# EAGLE design PSocC Motor Driver Design 1 (EAGLE 7.5.0)
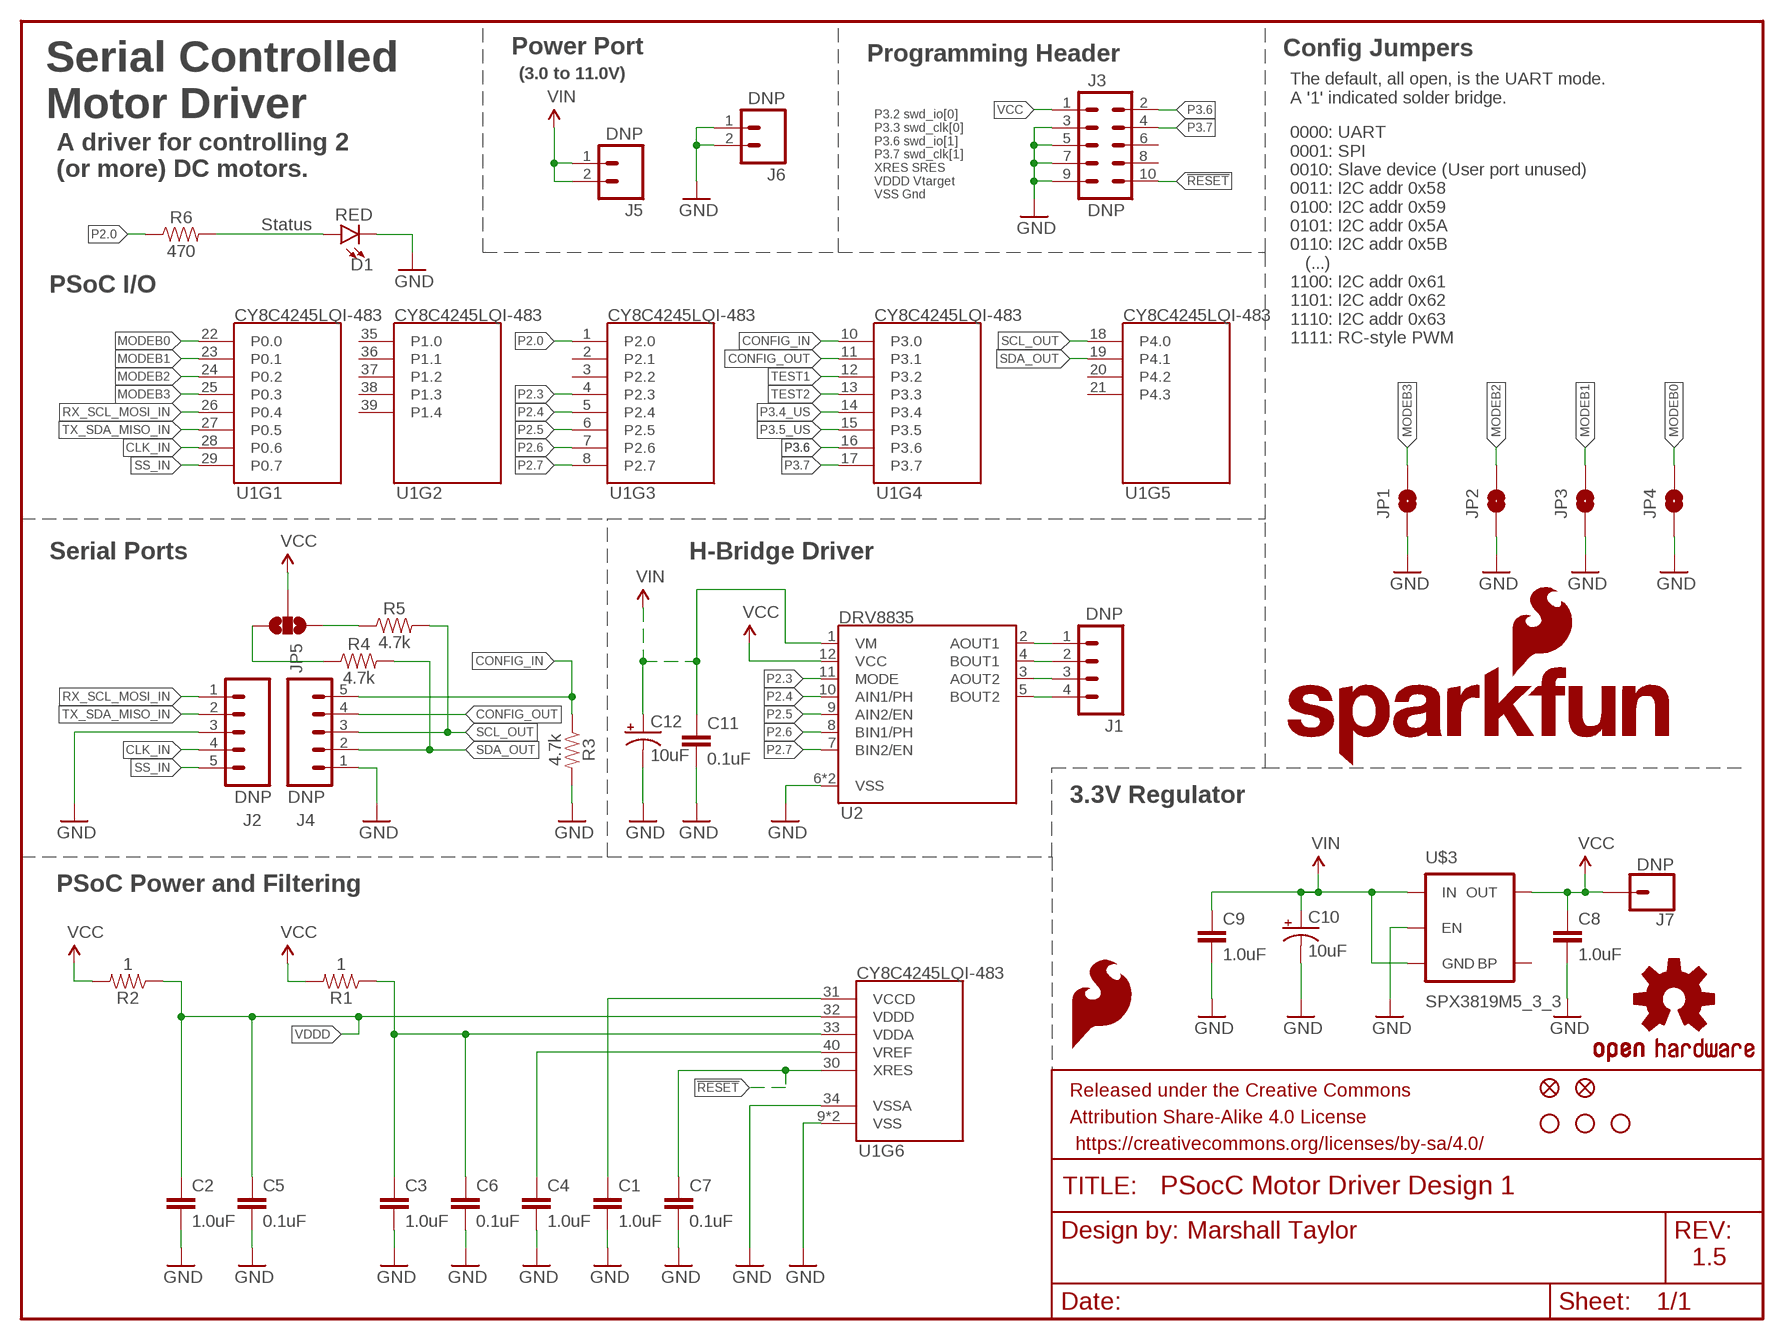
[diagram p0: schematic, sheet 1]

## Parts
C1  1.0uF  1.0UF-0402-16V-10%  [0402]
C2  1.0uF  1.0UF-0402-16V-10%  [0402]
C3  1.0uF  1.0UF-0402-16V-10%  [0402]
C4  1.0uF  1.0UF-0402-16V-10%  [0402]
C5  0.1uF  0.1UF-0402-16V-10%  [0402]
C6  0.1uF  0.1UF-0402-16V-10%  [0402]
C7  0.1uF  0.1UF-0402-16V-10%  [0402]
C8  1.0uF  1.0UF-0402-16V-10%  [0402]
C9  1.0uF  1.0UF-0402-16V-10%  [0402]
C10  10uF  10UF-POLAR-EIA3216-16V-10%(TANT)  [EIA3216]
C11  0.1uF  0.1UF-0402-16V-10%  [0402]
C12  10uF  10UF-POLAR-EIA3216-16V-10%(TANT)  [EIA3216]
D1  RED  LED-RED0603  [LED-0603]
FD1  FIDUCIALUFIDUCIAL  [MICRO-FIDUCIAL]
FD2  FIDUCIALUFIDUCIAL  [MICRO-FIDUCIAL]
FRAME1  FRAME-LETTER  [CREATIVE_COMMONS]
H1  STAND-OFF  [STAND-OFF]
H2  STAND-OFF  [STAND-OFF]
H3  STAND-OFF  [STAND-OFF]
J1  DNP  M04PTH  [1X04]
J2  DNP  M05PTH  [1X05]
J3  DNP  M05X20.05_IN_PTH_SILK  [2X5_PTH_SILK_.05]
J4  DNP  M05PTH  [1X05]
J5  DNP  M02PTH  [1X02]
J6  DNP  M02PTH  [1X02]
J7  DNP  CONN_01PTH  [1X01]
JP1  JUMPER-PAD-2  JUMPER-PAD-2-NOYES_SILK  [PAD-JUMPER-2-NO_YES_SILK]
JP2  JUMPER-PAD-2  JUMPER-PAD-2-NOYES_SILK  [PAD-JUMPER-2-NO_YES_SILK]
JP3  JUMPER-PAD-2  JUMPER-PAD-2-NOYES_SILK  [PAD-JUMPER-2-NO_YES_SILK]
JP4  JUMPER-PAD-2  JUMPER-PAD-2-NOYES_SILK  [PAD-JUMPER-2-NO_YES_SILK]
JP5  JUMPER-PAD-3-NOYES_SILK  [PAD-JUMPER-3-NO_YES_SILK]
LOGO1  SFE_LOGO_FLAME.1_INCH  [SFE_LOGO_FLAME_.1]
LOGO2  OSHW-LOGOMINI  [OSHW-LOGO-MINI]
LOGO3  SFE_LOGO_NAME_FLAME.1_INCH  [SFE_LOGO_NAME_FLAME_.1]
R1  1  1OHM-0603-1/10W-1%  [0603]
R2  1  1OHM-0603-1/10W-1%  [0603]
R3  4.7k  4.7KOHM-0603-1/10W-1%  [0603]
R4  4.7k  4.7KOHM-0603-1/10W-1%  [0603]
R5  4.7k  4.7KOHM-0603-1/10W-1%  [0603]
R6  470  470OHM-0603-1/10W-1%  [0603]
U1  CY8C4245LQI-483  CY8C4245LQI  [QFN-40]
U2  DRV8835  DRV883X  [WSON-12]
U$3  SPX3819M5_3_3  SPX3819  [SOT-23-5-VREG]

## Nets
!RESET: C7.1 J3.10 U1.30(XRES)
CLK_IN: J2.4 U1.28(P0.6)
CONFIG_IN: J4.5 R3.1 U1.10(P3.0)
CONFIG_OUT: J4.4 U1.11(P3.1)
GND: C1.2 C2.2 C3.2 C4.2 C5.2 C6.2 C7.2 C8.2 C9.2 C10.- C11.2 C12.- D1.C J2.3 J3.3 J3.5 J3.7 J3.9 J4.1 J6.1 J6.2 JP1.1 JP2.1 JP3.1 JP4.1 R3.2 U1.9(VSS) U1.34(VSSA) U1.EP(VSS) U2.6(VSS) U2.PAD(VSS) U$3.3(EN)
MODEB0: JP4.2 U1.22(P0.0)
MODEB1: JP3.2 U1.23(P0.1)
MODEB2: JP2.2 U1.24(P0.2)
MODEB3: JP1.2 U1.25(P0.3)
N$1: C1.1 U1.31(VCCD)
N$2: JP5.1 R5.1
N$3: C3.1 C6.1 R1.1 U1.33(VDDA)
N$4: C4.1 U1.40(VREF)
N$5: J1.1 U2.2(AOUT1)
N$6: J1.2 U2.4(BOUT1)
N$7: J1.4 U2.5(BOUT2)
N$8: J1.3 U2.3(AOUT2)
N$9: JP5.3 R4.1
N$10: D1.A R6.2
P2.0: R6.1 U1.1(P2.0)
P2.3: U1.4(P2.3) U2.11(MODE)
P2.4: U1.5(P2.4) U2.10(AIN1/PH)
P2.5: U1.6(P2.5) U2.9(AIN2/EN)
P2.6: U1.7(P2.6) U2.8(BIN1/PH)
P2.7: U1.8(P2.7) U2.7(BIN2/EN)
P3.4_US: U1.14(P3.4)
P3.5_US: U1.15(P3.5)
P3.6: J3.2 U1.16(P3.6)
P3.7: J3.4 U1.17(P3.7)
RX_SCL_MOSI_IN: J2.1 U1.26(P0.4)
SCL_OUT: J4.3 R5.2 U1.18(P4.0)
SDA_OUT: J4.2 R4.2 U1.19(P4.1)
SS_IN: J2.5 U1.29(P0.7)
TEST1: U1.12(P3.2)
TEST2: U1.13(P3.3)
TX_SDA_MISO_IN: J2.2 U1.27(P0.5)
VCC: C8.1 J3.1 J7.1 JP5.2 R1.2 R2.2 U2.12(VCC) U$3.5(OUT)
VDDD: C2.1 C5.1 R2.1 U1.32(VDDD)
VIN: C9.1 C10.+ C11.1 C12.+ J5.1 J5.2 U2.1(VM) U$3.1(IN) U$3.2(GND)
Unconnected: J3.6 J3.8 U1.2(P2.1) U1.3(P2.2) U1.20(P4.2) U1.21(P4.3) U1.35(P1.0) U1.36(P1.1) U1.37(P1.2) U1.38(P1.3) U1.39(P1.4) U$3.4(BP)

## Notes on the sheet
- Serial Controlled
  Motor Driver
- Power Port | Programming Header | Config Jumpers
- The default, all open, is the UART mode.
  A '1' indicated solder bridge.
- (3.0 to 11.0V)
- P3.2 swd_io[0]
  P3.3 swd_clk[0]
  P3.6 swd_io[1]
  P3.7 swd_clk[1]
  XRES SRES
  VDDD Vtarget
  VSS Gnd
- 0000: UART
  0001: SPI
  0010: Slave device (User port unused)
  0011: I2C addr 0x58
  0100: I2C addr 0x59
  0101: I2C addr 0x5A
  0110: I2C addr 0x5B
     (...)
  1100: I2C addr 0x61
  1101: I2C addr 0x62
  1110: I2C addr 0x63
  1111: RC-style PWM
- A driver for controlling 2
  (or more) DC motors.
- Status
- PSoC I/O
- Serial Ports | H-Bridge Driver
- 3.3V Regulator
- PSoC Power and Filtering
- Marshall Taylor
- 1.5

## Library data of the parts
C1-C4 C8 C9 = SparkFun-Capacitors:1.0UF: 1µF ceramic capacitors A capacitor is a passive two-terminal electrical component used to store electrical energy temporarily in an electric field.; PROD_ID: CAP-12417
C5-C7 C11 = SparkFun-Capacitors:0.1UF: 0.1µF ceramic capacitors A capacitor is a passive two-terminal electrical component used to store electrical energy temporarily in an electric field.; PROD_ID: CAP-12416
C10 C12 = SparkFun-Capacitors:10UF-POLAR: 10.0µF polarized capacitors A capacitor is a passive two-terminal electrical component used to store electrical energy temporarily in an electric field.; PROD_ID: CAP-00811
D1 = SparkFun-LED:LED-RED: Red SMD LED Used in manufacturing of most products at SparkFun 0603 - SMD 0603 package Forward Voltage: 1.9V Forward Current: 20mA Datasheet: [Product Link] <http://docs.avagotech.com/docs/AV02-0551EN> 0603 SMART - SMD 0603 SMART package ( more efficient and expensive) Forward Voltage: 1.8V Forward Current: 20mA Datasheet: [Product Link] <http://www.osram-os.com/Graphics/XPic2/00077099_0.pdf> 1206 - SMD 1206 package Forward Voltage: 2V Forward Current: 20mA Datasheet: [Product Link] <https://www.sparkfun.com/datasheets/DevTools/LilyPad/Q150OVS4.pdff> 1206 LilyPad - SMD 1206 LilyPad package Forward Voltage: 2V Forward Current: 20mA Datasheet: [Product Link] <https://www.sparkfun.com/datasheets/DevTools/LilyPad/Q150OVS4.pdf>; PROD_ID: DIO-00819
FD1 FD2 = SparkFun-Aesthetics:FIDUCIAL: Fiducial Alignment Points Various fiducial points for machine vision alignment.
FRAME1 = SparkFun-Aesthetics:FRAME-LETTER: Schematic Frame Standard 8.5x11 US Letter frame
H1-H3 = SparkFun-Electromechanical:STAND-OFF: #4 Stand Off This is the mechanical footprint for a #4 phillips button head screw. Use the keepout ring to avoid running the screw head into surrounding components. SKU : PRT-00447
J1 = SparkFun-Connectors:M04: Header 4 Standard 4-pin 0.1" header. Use with straight break away headers (SKU : PRT-00116), right angle break away headers (PRT-00553), swiss pins (PRT-00743), machine pins (PRT-00117), and female headers (PRT-00115). Molex polarized connector foot print use with SKU : PRT-08231 with associated crimp pins and housings. 1MM SMD Version SKU: PRT-10208; PROD_ID: CONN-09696
J2 J4 = SparkFun-Connectors:M05: Header 5 Standard 5-pin 0.1" header. Use with straight break away headers (SKU : PRT-00116), right angle break away headers (PRT-00553), swiss pins (PRT-00743), machine pins (PRT-00117), and female headers (PRT-00115). Molex polarized connector foot print use with SKU : PRT-08230 with associated crimp pins and housings.
J3 = SparkFun-Connectors:M05X2: Header 5x2 Standard 10-pin dual row 0.1" header. Commonly used with AVR-ISP. Use with Spark Fun Electronics SKU: PRT-00778
J5 J6 = SparkFun-Connectors:M02: Standard 2-pin 0.1" header. Use with - straight break away headers ( PRT-00116) - right angle break away headers (PRT-00553) - swiss pins (PRT-00743) - machine pins (PRT-00117) - female headers (PRT-00115) Molex polarized connector foot print use with: PRT-08233 with associated crimp pins and housings. 2.54_SCREWTERM for use with PRT-10571. 3.5mm Screw Terminal footprints for PRT-08084 5mm Screw Terminal footprints for use with PRT-08432
J7 = SparkFun-Connectors:CONN_01: Header 1 Standard 1-pin 0.1" header. Use with straight break away headers (SKU : PRT-00116), right angle break away headers (PRT-00553), swiss pins (PRT-00743), machine pins (PRT-00117), and female headers (PRT-00115). SMTSO-256-ET is a "flush mount" nut for a 4-40 screw. The older package used to be too tight, and did not allow it to sit properly thru the drill hit. The latest (0.165DIA) fits nice and snug.
JP1-JP4 = SparkFun-Passives:JUMPER-PAD-2-NO
JP5 = SparkFun-Passives:JUMPER-PAD-3-NO
LOGO1 = SparkFun-Aesthetics:SFE_LOGO_FLAME: SFE Logo, flame only This is the SparkFun flame logo. The logo on the schematic will always be the same size; the package variant is the height of the flame. Default layer for the logo on the board is tSilk.
LOGO2 = SparkFun-Aesthetics:OSHW-LOGO: Open Source Hardware Logo This logo indicates the piece of hardware it is found on incorporates a OSHW license and/or adheres to the definition of open source hardware found here: http://freedomdefined.org/OSHW
LOGO3 = SparkFun-Aesthetics:SFE_LOGO_NAME_FLAME: SFE Logo, name and flame This is the SparkFun full logo. The logo on the schematic will always be the same size; the package variant is the height of the flame part of the logo. Default layer for the logo on the board is tSilk.
R1 R2 = SparkFun-Resistors:1OHM: 1Ω resistor A resistor is a passive two-terminal electrical component that implements electrical resistance as a circuit element. Resistors act to reduce current flow, and, at the same time, act to lower voltage levels within circuits.; PROD_ID: RES-08269
R3-R5 = SparkFun-Resistors:4.7KOHM: 4.7kΩ resistor A resistor is a passive two-terminal electrical component that implements electrical resistance as a circuit element. Resistors act to reduce current flow, and, at the same time, act to lower voltage levels within circuits.; PROD_ID: RES-07857
R6 = SparkFun-Resistors:470OHM: 470Ω resistor A resistor is a passive two-terminal electrical component that implements electrical resistance as a circuit element. Resistors act to reduce current flow, and, at the same time, act to lower voltage levels within circuits.; PROD_ID: RES-07869
U1 = PSOC4TempLib:CY8C4245LQI: PSOC 4200; PROD_ID: IC-13292
U2 = PSOC4TempLib:DRV883X; PROD_ID: IC-13342
U$3 = PSOC4TempLib:SPX3819; PROD_ID: VREG-13321

## Board
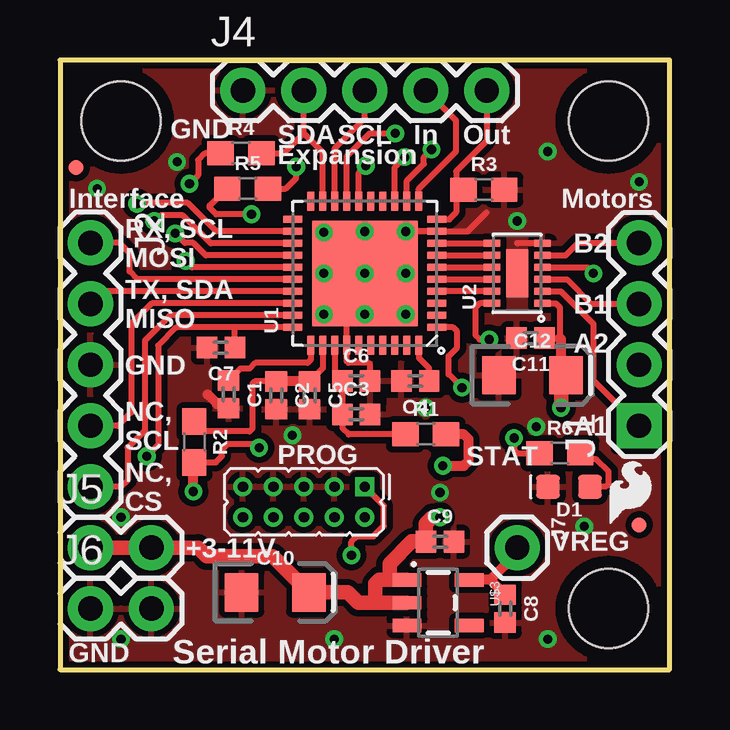
[diagram p1: board, top side]
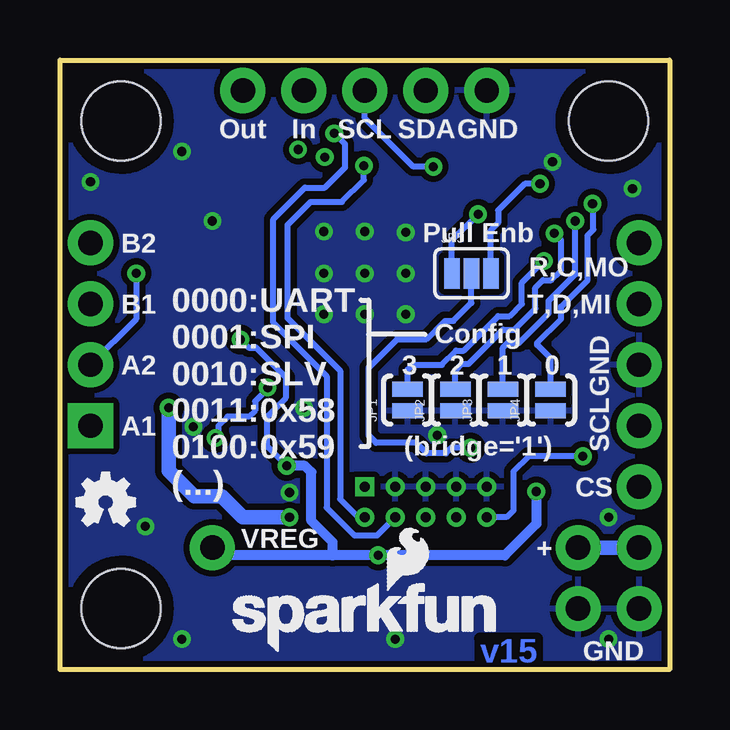
[diagram p2: board, bottom side, seen from below]

Size 25.4 x 25.4 mm. Coordinates in mm from the lower left corner, seen from the top.
Outline: 0,0 25.4,0 25.4,25.4 0,25.4 0,0
Copper layers (1*16): Top 0.035mm / dielectric 1.5mm / Bottom 0.035mm
Design rules "SparkFun-2-layer-TIGHT": minimum track width 7mil, minimum drill 15mil, track to track 7mil, track to pad 7mil, pad to pad 7mil, via to via 7mil, smd to smd 7mil, copper to edge 7mil, drill to drill 7mil, minimum pad ring 7mil, minimum via ring 7mil, stop-mask expansion 4mil, vias tented up to drill 25mil, thermal gap 10mil
tRestrict: area 12.1,18.7 to 13.3,18.9; area 12.1,14.1 to 13.4,14.3; area 10.3,15.9 to 10.5,17.1; area 14.9,15.9 to 15.1,17.1

### Footprints (pad centres in the part's own frame; a part is rotated, then mirrored left to right if it is on the bottom)
0402 = smd 0.85 x 0.9: 1 -0.58,0; 2 0.58,0
EIA3216 = smd 1.4 x 1.6: + 1.4,0; - -1.4,0
LED-0603 = smd 1 x 1: A 0,-0.877; C 0,0.877
MICRO-FIDUCIAL = smd 0.635 x 0.635: 1 0,0
STAND-OFF = hole 3.302: 0,0
1X04 = drill 1.016 pad 1.88 square: 1 0,0 | drill 1.016 pad 1.88: 2 2.54,0; 3 5.08,0; 4 7.62,0
1X05 = drill 1.016 pad 1.88: 1 0,0; 2 2.54,0; 3 5.08,0; 4 7.62,0; 5 10.16,0
2X5_PTH_SILK_.05 = drill 0.432 square: 1 0,6.35 | drill 0.432: 2 1.27,6.35; 3 0,5.08; 4 1.27,5.08; 5 0,3.81; 6 1.27,3.81; 7 0,2.54; 8 1.27,2.54; 9 0,1.27; 10 1.27,1.27
1X02 = drill 1.016 pad 1.88: 1 0,0; 2 2.54,0
1X01 = drill 1.016 pad 1.88: 1 0,0
PAD-JUMPER-2-NO_YES_SILK = smd 0.635 x 1.27: 1 -0.45,0; 2 0.45,0
PAD-JUMPER-3-NO_YES_SILK = smd 0.635 x 1.27: 1 -0.813,0; 2 0,0; 3 0.813,0
0603 = smd 1.1 x 1: 1 -0.85,0; 2 0.85,0
QFN-40 = smd 0.285 x 0.8: 1 -2.25,-3; 2 -1.75,-3; 3 -1.25,-3; 4 -0.75,-3; 5 -0.25,-3; 6 0.25,-3; 7 0.75,-3; 8 1.25,-3; 9 1.75,-3; 10 2.25,-3; 21 2.25,3; 22 1.75,3; 23 1.25,3; 24 0.75,3; 25 0.25,3; 26 -0.25,3; 27 -0.75,3; 28 -1.25,3; 29 -1.75,3; 30 -2.25,3 | smd 0.8 x 0.285: 11 3,-2.25; 12 3,-1.75; 13 3,-1.25; 14 3,-0.75; 15 3,-0.25; 16 3,0.25; 17 3,0.75; 18 3,1.25; 19 3,1.75; 20 3,2.25; 31 -3,2.25; 32 -3,1.75; 33 -3,1.25; 34 -3,0.75; 35 -3,0.25; 36 -3,-0.25; 37 -3,-0.75; 38 -3,-1.25; 39 -3,-1.75; 40 -3,-2.25 | smd 4.4 x 4.4: EP 0,0
WSON-12 = smd 0.3 x 0.7: 1 -1.25,-1.05; 2 -0.75,-1.05; 3 -0.25,-1.05; 4 0.25,-1.05; 5 0.75,-1.05; 6 1.25,-1.05; 7 1.25,1.05; 8 0.75,1.05; 9 0.25,1.05; 10 -0.25,1.05; 11 -0.75,1.05; 12 -1.25,1.05 | smd 2 x 0.9: PAD 0,0
SOT-23-5-VREG = smd 0.55 x 1.2: 1 -0.95,-1.3; 2 0,-1.3; 3 0.95,-1.3; 4 0.95,1.3; 5 -0.95,1.3

### Placement (x,y rotation side)
C1  7.02,11.47 270 top
C2  9.01,11.43 270 top
C3  12.34,10.64 0 top
C4  14.8,12.03 180 top
C5  10.4,11.43 270 top
C6  12.34,12.03 0 top
C7  6.71,13.41 180 top
C8  18.55,2.54 270 top
C9  15.84,5.33 0 top
C10  8.97,3.21 0 top
C11  19.61,13.81 180 top
C12  19.68,12.26 0 top
D1  21.21,7.62 90 top
FD1  0.67,20.92 0 top
FD2  24.13,6.03 0 top
FRAME1  -17.78,-19.05 0 top  (outside the outline)
H1  2.54,22.86 0 top
H2  22.86,2.54 0 top
H3  22.86,22.86 0 top
J1  24.13,10.16 90 top
J2  1.27,17.78 270 top
J3  6.35,7.62 270 top
J4  7.62,24.13 0 top
J5  1.27,5.08 0 top
J6  1.27,2.54 0 top
J7  19.05,5.08 270 top
JP1  10.91,11.23 90 bottom
JP2  8.93,11.23 90 bottom
JP3  6.95,11.23 90 bottom
JP4  4.96,11.23 90 bottom
JP5  8.26,16.51 0 bottom
LOGO1  22.61,5.75 0 top
LOGO2  23.5,6.99 0 bottom
LOGO3  18.61,0.67 0 bottom
R1  15.24,9.8 0 top
R2  5.6,9.49 270 top
R3  17.66,20 0 top
R4  7.54,21.51 0 top
R5  7.82,20.04 0 top
R6  20.83,9.02 0 top
U1  12.7,16.51 90 top
U2  19.05,16.51 90 top
U$3  15.76,2.79 270 top

### Tracks (layer width: path | path; a pad name or v marks a point on that pad's centre or on a via)
!RESET  (via drill 0.38)
  Top 0.254: U1.30 7.34,14.26 | 7.34,14.26 4.85,14.26 4.09,13.49 4.09,9.37 v3.61,8.89 | C7.1 7.29,14.21 7.34,14.26
  Bottom 0.254: v3.61,8.89 5.87,8.89 6.51,8.26 6.51,6.63 6.79,6.35 J3.10
CLK_IN
  Top 0.254: U1.28 3.83,15.26 2.98,14.41 2.98,10.72 2.42,10.16 J2.4
CONFIG_IN
  Top 0.254: J4.5 17.78,22.03 16.51,20.76 16.51,20.32 | U1.10 16.22,18.76 16.51,19.05 16.51,20.32 | R3.1 16.81,20.02 16.51,20.32
CONFIG_OUT
  Top 0.254: U1.11 14.95,20.03 16.51,21.59 16.51,22.86 J4.4
GND  (via drill 0.38)
  Top 0.254: C6.2 12.92,12.71 12.86,12.78 12.03,12.78 11.95,12.86 U1.34 11.95,15.76 U1.EP 14.45,18.26 U1.9 16.99,18.26 17.78,19.05 | U2.6 19.07,17.76 19.05,17.78 | C1.2 6.93,10.89 6.75,11.07 6.55,11.07
  Top 0.406: 6.55,11.07 6.15,11.47
  other vias: 15.84,7.38 21.84,5.97 11.43,1.27 24.13,20.32 2.54,6.35 15.24,10.91 19.05,18.69 19.84,10.12 4.88,21.15 1.55,20.04 9.68,9.76 20.32,21.59 12.7,14.8 14.41,14.8 10.99,14.8 10.99,16.51 12.7,16.51 14.41,16.51 14.41,18.26 12.7,18.26 10.99,18.22 20.32,1.27 2.54,1.27
  pour Top (isolate 0.254, rank 2): 0,25.4 0,0 25.4,0 25.4,25.4
  pour Bottom (isolate 0.254): 0,25.4 0,0 25.4,0 25.4,25.4
MODEB0  (via drill 0.38)
  Top 0.254: U1.22 6.5,18.26 5.32,19.45 3.25,19.45 v3.21,19.41
  Bottom 0.254: JP4.2 4.96,12.98 5.52,13.53 5.52,13.61 4.52,14.61 4.52,15.12 3.41,16.23 3.41,18.1 3.17,18.34 3.17,19.37 v3.21,19.41
MODEB1  (via drill 0.38)
  Top 0.254: U1.23 6.29,17.76 5.12,18.93 4.17,18.93 v3.93,18.69
  Bottom 0.254: JP3.2 6.95,13.41 6.75,13.61 6.27,13.61 5.04,14.84 5.04,15.36 3.93,16.47 v3.93,18.69
MODEB2  (via drill 0.38)
  Top 0.254: U1.24 6.08,17.26 5.56,17.78 5.2,17.78 v4.8,18.18
  Bottom 0.254: JP2.2 8.93,12.46 8.65,12.74 8.37,12.74 6.95,14.17 6.47,14.17 5.6,15.04 5.6,15.91 5.28,16.23 4.92,16.23 4.52,16.63 4.52,17.9 v4.8,18.18
MODEB3  (via drill 0.38)
  Top 0.254: U1.25 5.5,16.76 v5.24,17.03
  Bottom 0.254: JP1.2 10.91,12.5 10.72,12.7 9.48,12.7 8.89,13.29 8.57,13.29 7.14,14.72 6.67,14.72 6.15,15.24 6.15,16.11 v5.24,17.03
N$1
  Top 0.254: U1.31 10.45,12.91 10.32,12.78 8.14,12.78 7.9,12.54 7.52,12.54 C1.1
N$2  (via drill 0.38)
  Top 0.254: R5.1 6.95,20.04 6.23,19.33 6.23,19.25 6.51,18.97 v7.98,18.97
  Bottom 0.254: JP5.1 9.07,17.88 v7.98,18.97
N$3
  Top 0.254: U1.33 11.45,12.34 C6.1 C3.1 11.76,10.06 12.03,9.8 R1.1
N$4
  Top 0.254: U1.40 14.95,12.99 15.38,12.56 C4.1
N$5
  Top 0.254: U2.2 20.87,15.76 22.23,14.41 22.23,12.06 J1.1
N$6  (via drill 0.38)
  Top 0.254: U2.4 21.98,16.76 v22.23,16.51
  Bottom 0.254: v22.23,16.51 22.23,14.61 J1.2
N$7
  Top 0.254: U2.5 21.07,17.26 21.59,17.78 J1.4
N$8
  Top 0.254: U2.3 21.13,16.26 22.15,15.24 J1.3
N$9  (via drill 0.38)
  Top 0.254: R4.1 6.03,21.51 5.75,21.23 5.75,20.6 v5.4,20.24
  Bottom 0.254: v5.4,20.24 6.03,20.24 7.14,19.13 7.14,18.61 7.44,18.32 JP5.3
N$10
  Top 0.254: D1.A 22.06,7.65 22.76,7.65 22.86,7.75 22.86,8.26 22.35,8.76 21.93,8.76 R6.2
P2.0  (via drill 0.38)
  Top 0.254: v16.75,11.75 16.19,12.3 16.19,13.06 16.55,13.41 16.55,14.09 16.38,14.26 U1.1 | v18.92,9.65 18.92,9.14 19.05,9.02 R6.1
  Bottom 0.254: v16.75,11.75 16.75,11.7 17.27,11.18 17.27,10.79 17.53,10.54 18.41,10.54 18.8,10.16 18.8,9.78 v18.92,9.65
P2.3
  Top 0.254: U2.11 U1.4
P2.4
  Top 0.254: U1.5 U2.10
P2.5
  Top 0.254: U1.6 U2.9
P2.6
  Top 0.254: U1.7 U2.8
P2.7
  Top 0.254: U1.8 U2.7
P3.6  (via drill 0.38)
  Top 0.254: U1.16 12.45,20.7 v12.74,21
  Bottom 0.254: J3.2 12.98,6.35 13.73,7.1 13.73,12.46 15.91,14.64 15.91,18.53 14.96,19.49 13.65,19.49 12.74,20.4 v12.74,21
P3.7  (via drill 0.38)
  Top 0.254: U1.17 11.95,21.4 12.9,22.34 v13.97,22.34
  Bottom 0.254: J3.4 12.18,5.6 13.14,5.6 14.29,6.75 14.29,12.22 16.51,14.45 16.51,18.77 15.2,20.08 14.37,20.08 13.53,20.91 13.53,21.91 v13.97,22.34
RX_SCL_MOSI_IN
  Top 0.254: U1.26 3.23,16.26 2.9,16.59 2.9,17.34 2.46,17.78 J2.1
SCL_OUT  (via drill 0.38)
  Top 0.254: U1.18 11.45,21.73 12.7,22.98 J4.3 | R5.2 9.41,20.04 9.84,20.48 v9.84,20.95
  Bottom 0.254: v9.84,20.95 10.68,20.95 12.7,22.98 J4.3
SDA_OUT
  Top 0.254: U1.19 10.95,21.55 10.16,22.34 | 10.16,22.34 J4.2 | R4.2 9.33,21.51 10.16,22.34
SS_IN
  Top 0.254: U1.29 4.6,14.76 3.53,13.69 3.53,9.96 2.82,9.25 2.82,7.9 2.54,7.62 J2.5
TEST1  (via drill 0.38)
  Top 0.254: U1.12 14.45,20.36 15.16,21.07 15.16,21.35 v15.48,21.67
TEST2  (via drill 0.38)
  Top 0.254: U1.13 13.95,20.93 v14.37,21.35
TX_SDA_MISO_IN
  Top 0.254: U1.27 1.79,15.76 J2.2
VCC  (via drill 0.38)
  Top 0.254: U2.12 17.48,15.26 17.3,15.08 17.3,13.94 17.49,13.76 v17.88,13.76 | v12.14,4.76 12.14,5.32 12.38,5.56 13.06,5.56 13.49,5.99 13.49,6.83 J3.1 | R2.2 6.49,8.63 6.75,8.89 6.75,9.17 6.99,9.41 8.14,9.41 v8.29,9.25
  Top 0.406: R1.2 16.83,9.8 17.03,9.6 17.03,8.69 16.83,8.49 v15.95,8.49 | v5.56,7.42 5.56,8.63 R2.2 | C8.1 17.93,3.74 | 17.93,3.74 U$3.5 | 17.93,3.74 19.05,4.85 J7.1
  Bottom 0.254: v8.29,9.25 9.09,9.25 9.33,9.01 10.12,9.01 10.56,9.45 12.22,9.45 12.54,9.76 12.54,12.58 11.35,13.77 10.12,13.77 9.37,14.53 9.01,14.53 8.26,15.28 JP5.2 | v17.88,13.76 17.54,13.41 17.22,13.41 15.99,12.18 15.99,11.31 16.79,10.52 16.79,9.33 v15.95,8.49
  Bottom 0.406: v5.56,7.42 5.56,6.07 6.87,4.76 v12.14,4.76 14.05,4.76 | 14.05,4.76 18.73,4.76 J7.1 | 14.05,4.76 14.05,5.32 14.93,6.2 14.93,8.22 15.2,8.49 v15.95,8.49
VDDD
  Top 0.254: U1.32 10.95,12.56 C5.1 | C2.1 8.12,12.01 8.02,11.91 8.02,10.04 7.9,9.92 6.05,9.92 5.64,10.34 R2.1
  Top 0.406: C5.1 C2.1
VIN  (via drill 0.38)
  Top 0.254: C11.1 20.84,13.81 20.84,15.08 20.66,15.26 U2.1
  Top 0.406: 20.84,13.81 20.88,13.77 20.88,12.47 C12.+ | 14.45,2.78 U$3.2 | 15.24,5.34 C9.1 15.26,5.21
  Top 0.61: J5.1 J5.2 5.75,5.08 6.11,4.72 8.86,4.72 C10.+ 11.99,3.21 12.42,2.78 13.14,2.78 | v20.88,10.91 20.88,12.47 | 13.14,2.78 14.45,2.78 | U$3.1 13.3,3.74 | 13.3,3.74 13.14,3.57 13.14,2.78 | v15.84,6.35 15.52,6.35 15.24,6.07 15.24,5.34 | C9.1 15.24,5.34 14.66,5.34 13.73,4.41 13.73,3.75 13.31,3.75 13.3,3.74
  Bottom 0.61: v15.84,6.35 17.78,6.35 18.65,7.22 19.8,7.22 20.88,8.29 v20.88,10.91 | J5.1 J5.2

### Text on the board
Bottom: v15
tPlace: GND | SDA | SCL | In | Out | Expansion | Interface | Motors | RX, SCL / MOSI | B2 | TX, SDA / MISO | B1 | A2 | GND | NC, / SCL | A1 | PROG | STAT | NC, / CS | +3-11V | VREG | GND | Serial Motor Driver
bPlace: GND | SDA | SCL | In | Out | Pull Enb | B2 | R,C,MO | T,D,MI | B1 | GND | Config | 0 | 1 | 2 | 3 | A2 | 0000:UART / 0001:SPI / 0010:SLV / 0011:0x58 / 0100:0x59 / (...) | SCL | A1 | (bridge='1') | CS | + | VREG | GND
Measures: Measurements in inches.
tDocu: Marshall Taylor